# Altium schematic sheet Serial Power Supply - Main-Steven’s iMac.SchDoc
size Legal
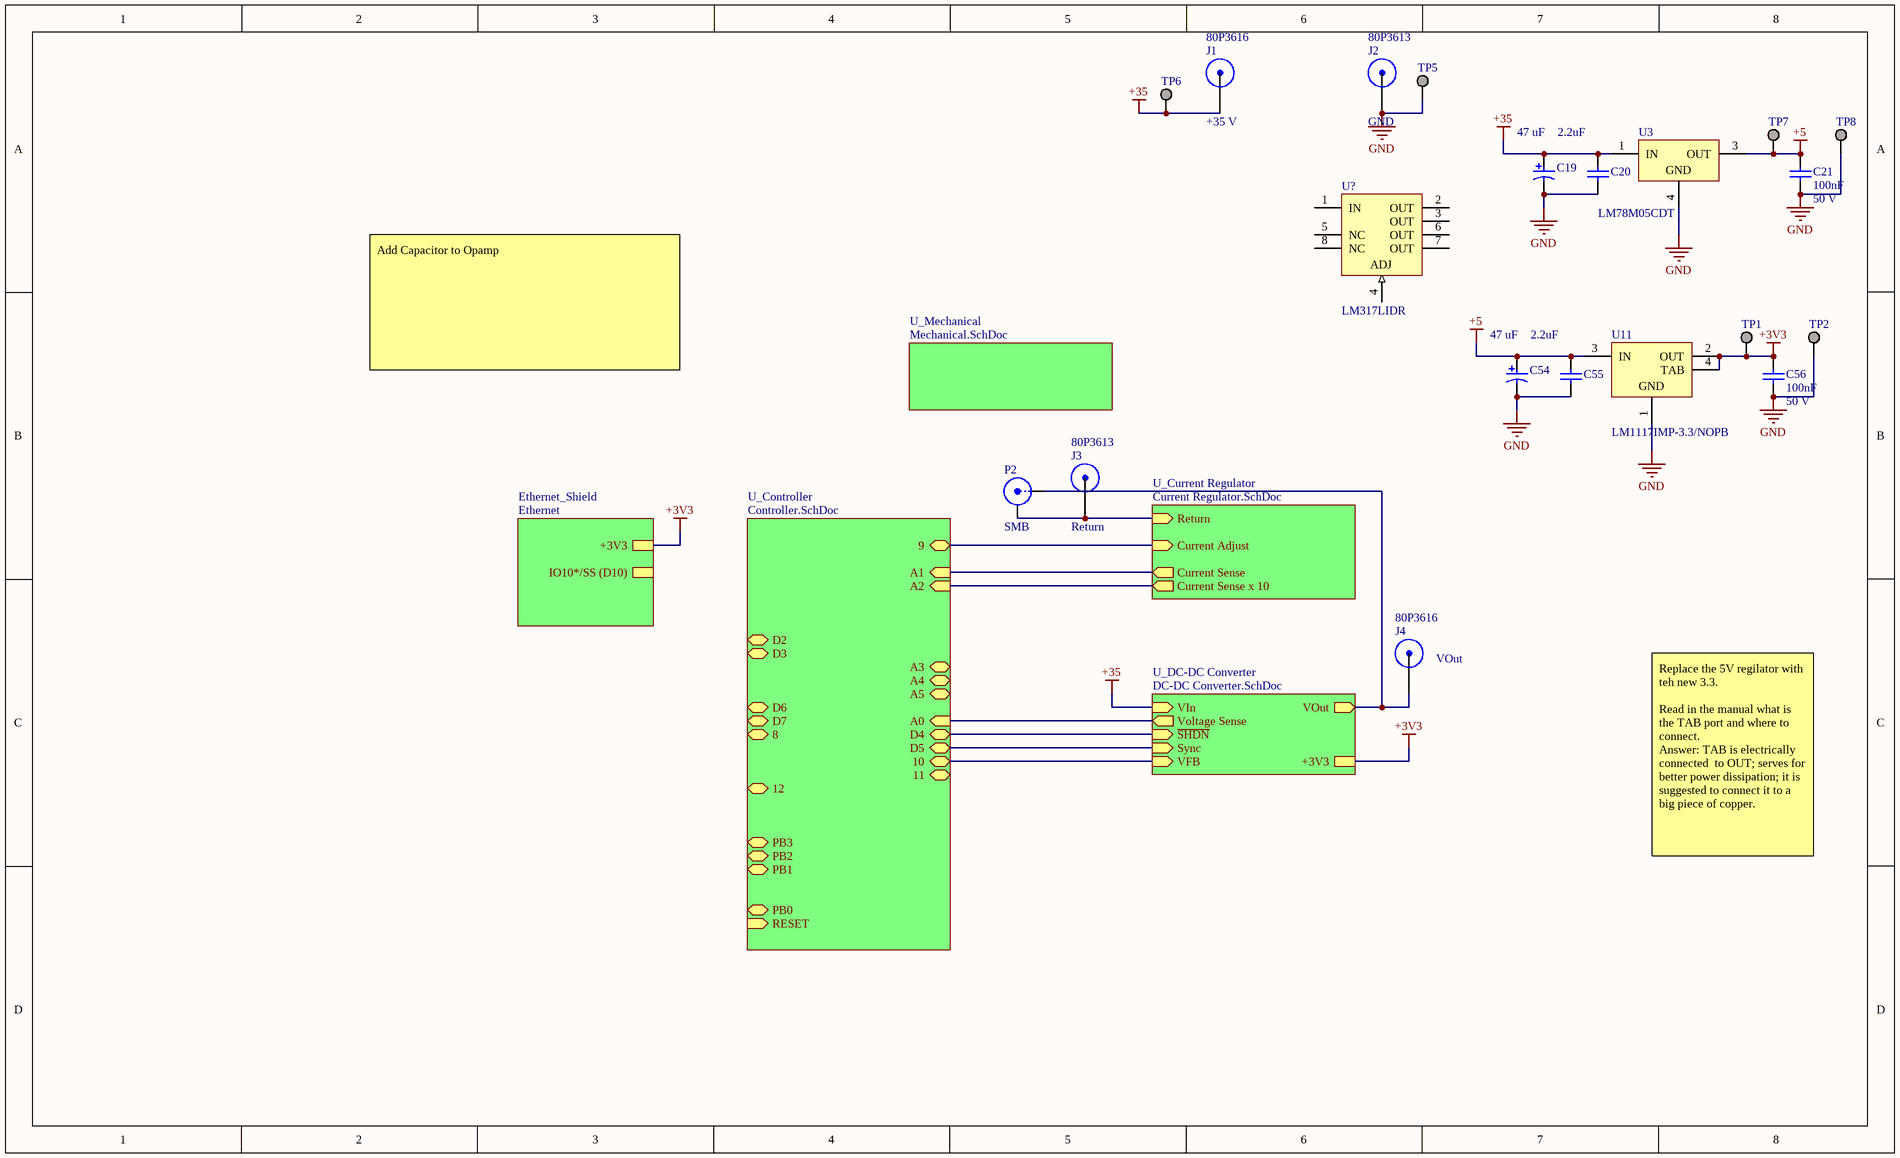
[diagram p0: Serial Power Supply - Main-Steven’s iMac.SchDoc]

## Parts
C19  Rated Capacitance: 47 uF  [NIC-CAPA2-10X10_V]  (hidden comment: UCZ1J470MCS1GS)
C20  value 2.2uF  [CAPC1812(4532)280_L]  (hidden comment: CAP 2.2uF 100V 1812(4532))
C21  value 100nF  Rated Voltage: 50 V  [CAPC1206(3216)100_L]  (hidden comment: CAP 100nF 50V 1206(3216))
C54  Rated Capacitance: 47 uF  [NIC-CAPA2-10X10_V]  (hidden comment: UCZ1J470MCS1GS)
C55  value 2.2uF  [CAPC1812(4532)280_L]  (hidden comment: CAP 2.2uF 100V 1812(4532))
C56  value 100nF  Rated Voltage: 50 V  [CAPC1206(3216)100_L]  (hidden comment: CAP 100nF 50V 1206(3216))
J1  +35 V  Supplier Part Number 1: 80P3616  [PCB-1keg917tfggg2k36z9zw-1]
J2  GND  Supplier Part Number 1: 80P3613  [PCB-1keg917tfggg2k36z9zw-1]
J3  Return  Supplier Part Number 1: 80P3613  [PCB-1keg917tfggg2k36z9zw-1]
J4  VOut  Supplier Part Number 1: 80P3616  [PCB-1keg917tfggg2k36z9zw-1]
P2  SMB  [SMB_V-RJ45]
TP1  +5 V  [KSTN-1502-2]  (value not drawn)
TP2  GND  [KSTN-1502-2]  (value not drawn)
TP5  GND  [KSTN-1502-2]  (value not drawn)
TP6  +20V  [KSTN-1502-2]  (value not drawn)
TP7  +5 V  [KSTN-1502-2]  (value not drawn)
TP8  GND  [KSTN-1502-2]  (value not drawn)
U3  LM78M05CDT  [TD03B_L]
U11  LM1117IMP-3.3/NOPB  [DCY0004A_N]
U?  LM317LIDR  [D0008A_M]

## Sub-sheets
Ethernet_Shield = Ethernet: +3V3, IO10*/SS (D10)
U_Controller = Controller.SchDoc: PB3 (bidir), PB2 (bidir), PB1 (bidir), PB0 (bidir), RESET (in), D2 (bidir), A0 (in), 9 (bidir), D4 (bidir), A5 (bidir), 10 (bidir), A1 (in), D6 (bidir), A3 (bidir), A2 (in), 11 (bidir), 8 (bidir), 12 (bidir), D3 (bidir), A4 (bidir), D7 (bidir), D5 (bidir)
U_Current Regulator = Current Regulator.SchDoc: Return (in), Current Adjust (in), Current Sense x 10 (out), Current Sense (out)
U_DC-DC Converter = DC-DC Converter.SchDoc: Sync (in), VIn (in), ~{SHDN} (in), VOut (out), VFB (in), Voltage Sense (out), +3V3
U_Mechanical = Mechanical.SchDoc: no entries

## Nets
+3V3: C56.1 TP1.1 U11.2(OUT) U11.4(TAB) ; sheet U_DC-DC Converter/+3V3, sheet Ethernet_Shield/+3V3
+5: C21.1 C54.1 C55.2 TP7.1 U3.3(OUT) U11.3(IN)
+35: C19.1 C20.2 J1.1 TP6.1 U3.1(IN) ; sheet U_DC-DC Converter/VIn
GND: C19.2 C20.1 C21.2 C54.2 C55.1 C56.2 J2.1 TP2.1 TP5.1 TP8.1 U3.4(GND) U11.1(GND)
NetJ3_1: J3.1 P2.2(Y) ; sheet U_Current Regulator/Return
NetJ4_1: J4.1 P2.1(X) ; sheet U_DC-DC Converter/VOut
(unnamed): sheet U_DC-DC Converter/Sync, sheet U_Controller/D5
(unnamed): sheet U_DC-DC Converter/~{SHDN}, sheet U_Controller/D4
(unnamed): sheet U_DC-DC Converter/VFB, sheet U_Controller/10
(unnamed): sheet U_DC-DC Converter/Voltage Sense, sheet U_Controller/A0
(unnamed): sheet U_Controller/9, sheet U_Current Regulator/Current Adjust
(unnamed): sheet U_Controller/A1, sheet U_Current Regulator/Current Sense
(unnamed): sheet U_Controller/A2, sheet U_Current Regulator/Current Sense x 10

Not connected (* = marked no-connect by the designer): U? 1(IN) 2(OUT) 3(OUT) 4(ADJ) 5(NC) 6(OUT) 7(OUT) 8(NC)

## Notes on the sheet
- Add Capacitor to Opamp
- Replace the 5V regilator with teh new 3.3.
  Read in the manual what is the TAB port and where to connect.
  Answer: TAB is electrically connected  to OUT; serves for better power dissipation; it is suggested to connect it to a big piece of copper.
- Title
- Size:
- Date:
- Legal
- Number:
- Time:
- Revision:
- Sheet
- of
- File:

## Library data of the parts
C19 C54 = CMP-0687-00002-1: Aluminum Electrolytic Capacitor, UD Series, Low Impedance, 470 uF, 25 V, + / - 20%, -55 to 105 degC, Chip Type, 10 x 10 mm D x L, Pb-Free, Reel; Manufacturer: Nichicon; Impedance: 0.09 Ohm; Endurance Time: 5000 h; Rated Ripple Current (at 100kHz): 670 mA; Packing: Dia382mm Reel; Rated Voltage: 63V; Tolerance Rated Capacitance: -20 to 20%; ComponentLink3URL: http://products.nichicon.co.jp/en/pdf/XJA043/e-ud.pdf; ComponentLink2URL: http://products.nichicon.co.jp/en/pdf/XJA043/e-ud.pdf; Length: 10 mm; PartNumber: UCZ1J470MCS1GS; ComponentLink3Description: Package Specification; PackageReference: CAPAE-D10H10; ComponentLink1URL: http://www.nichicon.co.jp/; DatasheetVersion: 08/2012; ComponentLink1Description: Manufacturer URL; ComponentLink2Description: Datasheet; Diameter: 10 mm; PackageDescription: 2-Pin Surface Mount Device, Diameter 10 mm, Height 10 mm, Pitch 8 mm; RoHS: TRUE; Mounting Technology: Surface Mount; Supplier 1: Mouser; Supplier Part Number 1: 647-UCZ1J470MCS1GS
C20 C55 = CMP-1040-01635-1: CAP 2.2uF 100V ±10% 1812 (4532 Metric) Thickness 2.8mm SMD; Case-Metric: 4532; Case-EIA: 1812; Tolerance: Â±10%; Rated Voltage: 100 V; Max Thickness: 2.8 mm; Technology: SMT; Supplier 1: Digi-Key; Supplier Part Number 1: 445-4510-2-ND
C21 C56 = CMP-1037-04202-1: CAP 100nF 50V ±10% 1206 (3216 Metric) Thickness 1mm SMD; Case-Metric: 3216; Tolerance: Â±10%; Case-EIA: 1206; Technology: SMT; Max Thickness: 1 mm
J1 J4 = SYM-20399854-1: Banana Socket, 20a, 4mm, Pcb, Red; Supplier 1: Newark
J2 J3 = SYM-20399854-1: Banana Socket, 20a, 4mm, Pcb, Black; Supplier 1: Newark
P2 = SMB: SMB Straight Connector; LatestRevisionDate: 17-Jul-2002; LatestRevisionNote: Re-released for DXP Platform.; Publisher: Altium Limited
TP1 TP2 TP5-TP8 = CMP-1672-00001-4: Terminal DBL Turret, Through Hole, RoHS; Contact Finish: Tin; Lead Pitch: 0.218 inch; PackageReference: 1502-2; Mount: Through Hole; Pins: 50; DatasheetVersion: Rev. A, 02/2008; RoHSCompliant: true; REACH SVHC: No SVHC; Contact Material: Brass; Length: 2.77 mm; PackageDescription: 1-Pin Through Hole Device, Dia 3.18 mm; Package Quantity: 1; Mounting Technology: Through Hole; Supplier 1: Mouser; Supplier Part Number 1: 575-2501200800000
U3 = CMP-0062-00202-1: 3-Terminal Positive Voltage Regulators, 3-pin TO-252; Manufacturer: National Semiconductor; PowerWise: N; PackageTopMarking: NSUZXYTT*LM78M05*CDT; CompType: LDO IC; DatasheetVersion: Aug-2005; RoHS: N; PackageReference: TD03B; Code_JEDEC: TO-252-AA; PinCount: 3; PackageVersion: revD, Feb-2009; PackageDescription: TO252, Molded, Jedec, 6.8 x 6.10 x 2.30mm Body, 3 Lead, 2.28mm Pitch, Surface Mount
U11 = CMP-0062-01631-4: 800mA Low-Dropout Linear Regulator, 4-pin SOT-223, Pb-Free; Manufacturer: Texas Instruments; PackageTopMarking: XYTT*N05B; PowerWise: N; High-Reliability: Y; CompType: LDO IC; Code_IPC: SOT223-4; PackageReference: DCY0004A; PinCount: 4; PackageDescription: Molded SOT-223, 6.50 x 3.56 x 1.6mm Body, 4 Lead, 2.3mm Pitch; PartNumber: LM1117IMP-3.3/NOPB; RoHS: Y; ComponentLink1Description: Datasheet URL; Code_JEDEC: TO-261-AA; ComponentLink1URL: http://www.ti.com/general/docs/lit/getliterature.tsp?genericPartNumber=LM1117-N&fileType=pdf
U? = CMP-0324-00101-3: Adjustable Regulator with 3.7 to 38 V Input and 1.2 to 32 V Output, -40 to 125 degC, 8-Pin SOIC (D), Green (RoHS & no Sb/Br); Manufacturer: Texas Instruments; Vin(Min)(V): 3.7; Vout(Max)(V): 32; Iout(Max)(A): 0.1; Vin(Max)(V): 38; Vout(Min)(V): 1.2; PackageVersion: revM, Jun-2011; ComponentLink3URL: Samples URL:http://www.ti.com/product/lm317l#samples; PackageDescription: 8-Pin Plastic Small Outline Integrated Circuit, 4.9 x 3.9 mm, Pitch 1.27 mm Pitch; ComponentLink1URL: http://www.ti.com/general/docs/lit/getliterature.tsp?genericPartNumber=LM317L&fileType=pdf; ComponentLink1Description: Datasheet; PartNumber: LM317LIDR; ComponentLink2URL: http://www.ti.com/litv/pdf/msoi002j; PackageReference: D0008A; DatasheetVersion: SLCS144D; Eco-Plan: Green (RoHS & no Sb/Br); Code_JEDEC: MS-012AA; ComponentLink3Description: URL Link1; ComponentLink2Description: Package Specification; Mounting Technology: Surface Mount